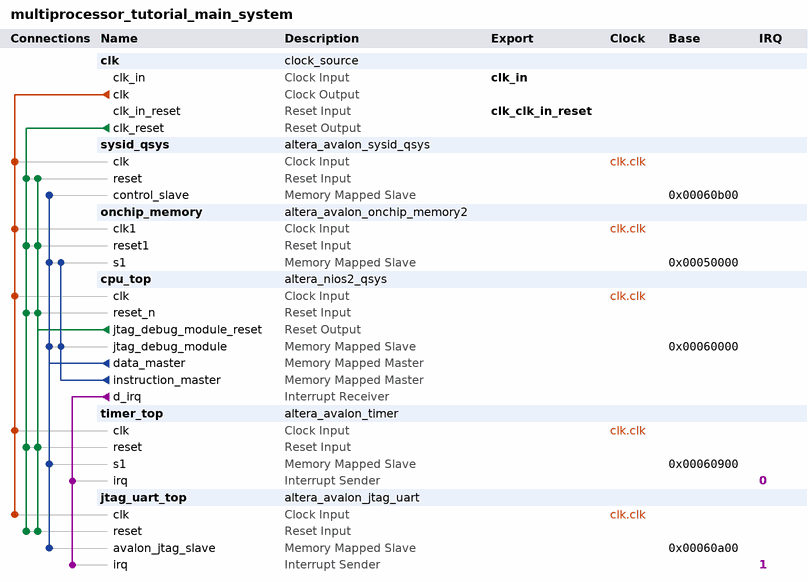
[diagram p0: system contents]
# Platform Designer (Qsys) system multiprocessor_tutorial_main_system
# Parameters at their usual value, and those the tool derives, are not listed.
package require -exact qsys 11.0
create_system multiprocessor_tutorial_main_system
set_project_property DEVICE_FAMILY CYCLONEIII

add_instance clk clock_source 11.0
set_instance_parameter_value clk clockFrequency 50000000

add_instance sysid_qsys altera_avalon_sysid_qsys 11.0
set_instance_parameter_value sysid_qsys id 0

add_instance onchip_memory altera_avalon_onchip_memory2 11.0
set_instance_parameter_value onchip_memory dataWidth 32
set_instance_parameter_value onchip_memory dualPort false
set_instance_parameter_value onchip_memory initMemContent true
set_instance_parameter_value onchip_memory initializationFileName onchip_memory
set_instance_parameter_value onchip_memory memorySize 65536

add_instance cpu_top altera_nios2_qsys 11.0
set_instance_parameter_value cpu_top muldiv_divider true
set_instance_parameter_value cpu_top mmu_autoAssignTlbPtrSz false
set_instance_parameter_value cpu_top resetOffset 40960
set_instance_parameter_value cpu_top exceptionOffset 40992
set_instance_parameter_value cpu_top cpuID 5
set_instance_parameter_value cpu_top resetSlave onchip_memory.s1
set_instance_parameter_value cpu_top exceptionSlave onchip_memory.s1
set_instance_parameter_value cpu_top breakSlave cpu_top.jtag_debug_module
set_instance_parameter_value cpu_top impl Fast
set_instance_parameter_value cpu_top icache_size 32768
set_instance_parameter_value cpu_top dcache_size 32768

add_instance timer_top altera_avalon_timer 11.0
set_instance_parameter_value timer_top period 10
set_instance_parameter_value timer_top periodUnits MSEC
set_instance_parameter_value timer_top timerPreset CUSTOM

add_instance jtag_uart_top altera_avalon_jtag_uart 11.0
set_instance_parameter_value jtag_uart_top simInteractiveOptions INTERACTIVE_ASCII_OUTPUT

# connections
add_connection clk.clk cpu_top.clk clock
add_connection clk.clk jtag_uart_top.clk clock
add_connection clk.clk onchip_memory.clk1 clock
add_connection clk.clk sysid_qsys.clk clock
add_connection clk.clk timer_top.clk clock
add_connection clk.clk_reset cpu_top.reset_n reset
add_connection clk.clk_reset jtag_uart_top.reset reset
add_connection clk.clk_reset onchip_memory.reset1 reset
add_connection clk.clk_reset sysid_qsys.reset reset
add_connection clk.clk_reset timer_top.reset reset
add_connection cpu_top.jtag_debug_module_reset cpu_top.reset_n reset
add_connection cpu_top.jtag_debug_module_reset jtag_uart_top.reset reset
add_connection cpu_top.jtag_debug_module_reset onchip_memory.reset1 reset
add_connection cpu_top.jtag_debug_module_reset sysid_qsys.reset reset
add_connection cpu_top.jtag_debug_module_reset timer_top.reset reset
add_connection cpu_top.data_master cpu_top.jtag_debug_module avalon
set_connection_parameter_value cpu_top.data_master/cpu_top.jtag_debug_module baseAddress 0x00060000
add_connection cpu_top.data_master jtag_uart_top.avalon_jtag_slave avalon
set_connection_parameter_value cpu_top.data_master/jtag_uart_top.avalon_jtag_slave baseAddress 0x00060a00
add_connection cpu_top.data_master onchip_memory.s1 avalon
set_connection_parameter_value cpu_top.data_master/onchip_memory.s1 baseAddress 0x00050000
add_connection cpu_top.data_master sysid_qsys.control_slave avalon
set_connection_parameter_value cpu_top.data_master/sysid_qsys.control_slave baseAddress 0x00060b00
add_connection cpu_top.data_master timer_top.s1 avalon
set_connection_parameter_value cpu_top.data_master/timer_top.s1 baseAddress 0x00060900
add_connection cpu_top.instruction_master cpu_top.jtag_debug_module avalon
set_connection_parameter_value cpu_top.instruction_master/cpu_top.jtag_debug_module baseAddress 0x00060000
add_connection cpu_top.instruction_master onchip_memory.s1 avalon
set_connection_parameter_value cpu_top.instruction_master/onchip_memory.s1 baseAddress 0x00050000
add_connection cpu_top.d_irq jtag_uart_top.irq interrupt
set_connection_parameter_value cpu_top.d_irq/jtag_uart_top.irq irqNumber 1
add_connection cpu_top.d_irq timer_top.irq interrupt
set_connection_parameter_value cpu_top.d_irq/timer_top.irq irqNumber 0

# exported interfaces
add_interface clk_in clock sink
set_interface_property clk_in EXPORT_OF clk.clk_in
add_interface clk_clk_in_reset reset sink
set_interface_property clk_clk_in_reset EXPORT_OF clk.clk_in_reset

save_system multiprocessor_tutorial_main_system.qsys
